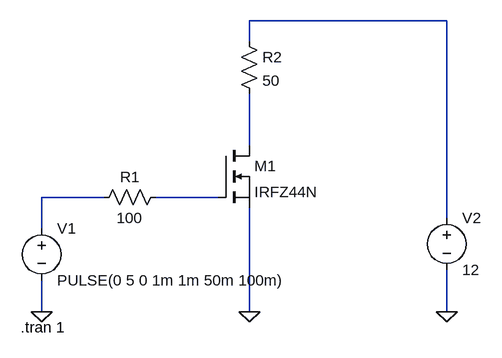
[diagram p0: schematic Draft1.asc]
Draft1.asc, the LTspice schematic file:
Version 4.1
SHEET 1 880 680
WIRE 528 -64 224 -64
WIRE 224 -32 224 -64
WIRE 224 128 224 48
WIRE 0 208 -96 208
WIRE 176 208 80 208
WIRE 528 240 528 -64
WIRE -96 256 -96 208
WIRE -96 384 -96 336
WIRE 224 384 224 224
WIRE 528 384 528 320
FLAG -96 384 0
FLAG 224 384 0
FLAG 528 384 0
SYMBOL nmos 176 128 R0
SYMATTR InstName M1
SYMATTR Value IRFZ44N
SYMBOL voltage -96 240 R0
WINDOW 123 0 0 Left 0
WINDOW 39 0 0 Left 0
SYMATTR InstName V1
SYMATTR Value PULSE(0 5 0 1m 1m 50m 100m)
SYMBOL res 96 192 R90
WINDOW 0 0 56 VBottom 2
WINDOW 3 32 56 VTop 2
SYMATTR InstName R1
SYMATTR Value 100
SYMBOL voltage 528 224 R0
WINDOW 123 0 0 Left 0
WINDOW 39 0 0 Left 0
SYMATTR InstName V2
SYMATTR Value 12
SYMBOL res 208 -48 R0
SYMATTR InstName R2
SYMATTR Value 50
TEXT -128 408 Left 2 !.tran 1

The netlist it stands for:
* Draft1.asc
M1 N002 N004 0 0 IRFZ44N
V1 N003 0 PULSE(0 5 0 1m 1m 50m 100m)
R1 N004 N003 100
V2 N001 0 12
R2 N001 N002 50
.model NMOS NMOS
.model PMOS PMOS
.lib standard.mos
.tran 1
.backanno
.end